# EAGLE schematic cyclops (EAGLE 8.3.2)
DESIGNER: JONATHAN P. NEWMAN; DOC_NUMBER: N/A; REVISION: 3.7
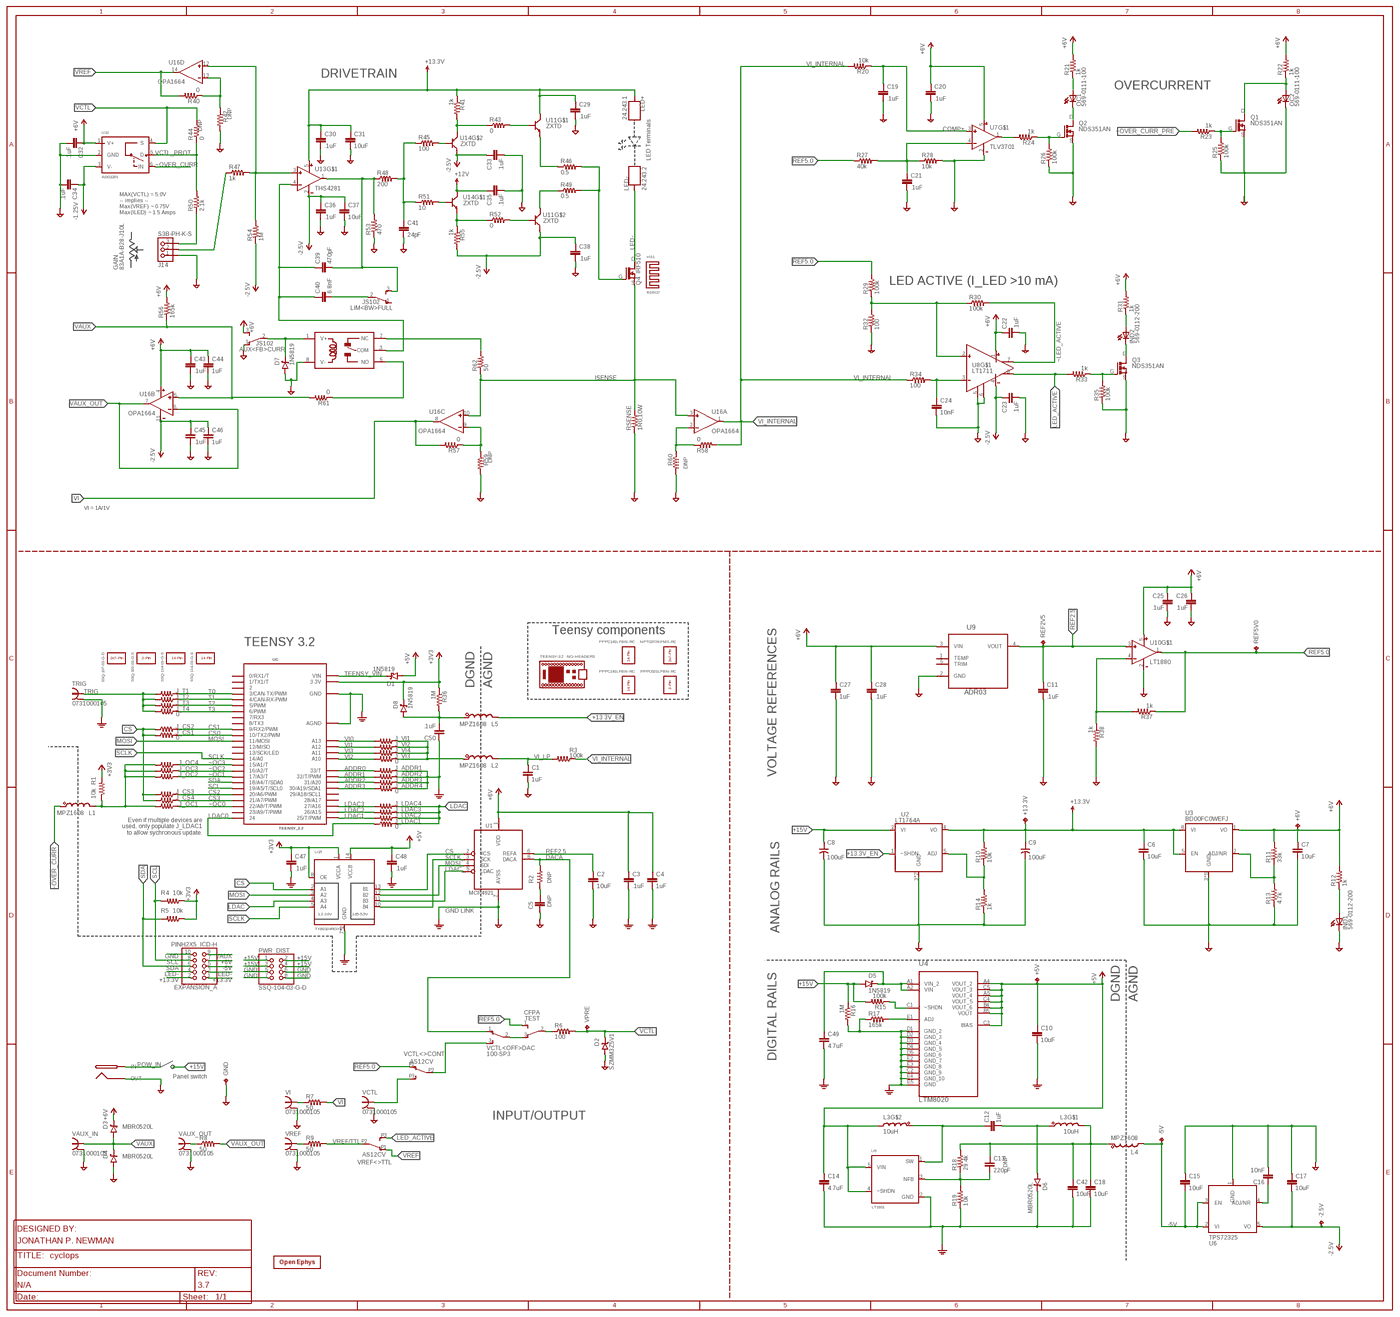
[diagram p0: schematic, sheet 1, overview]
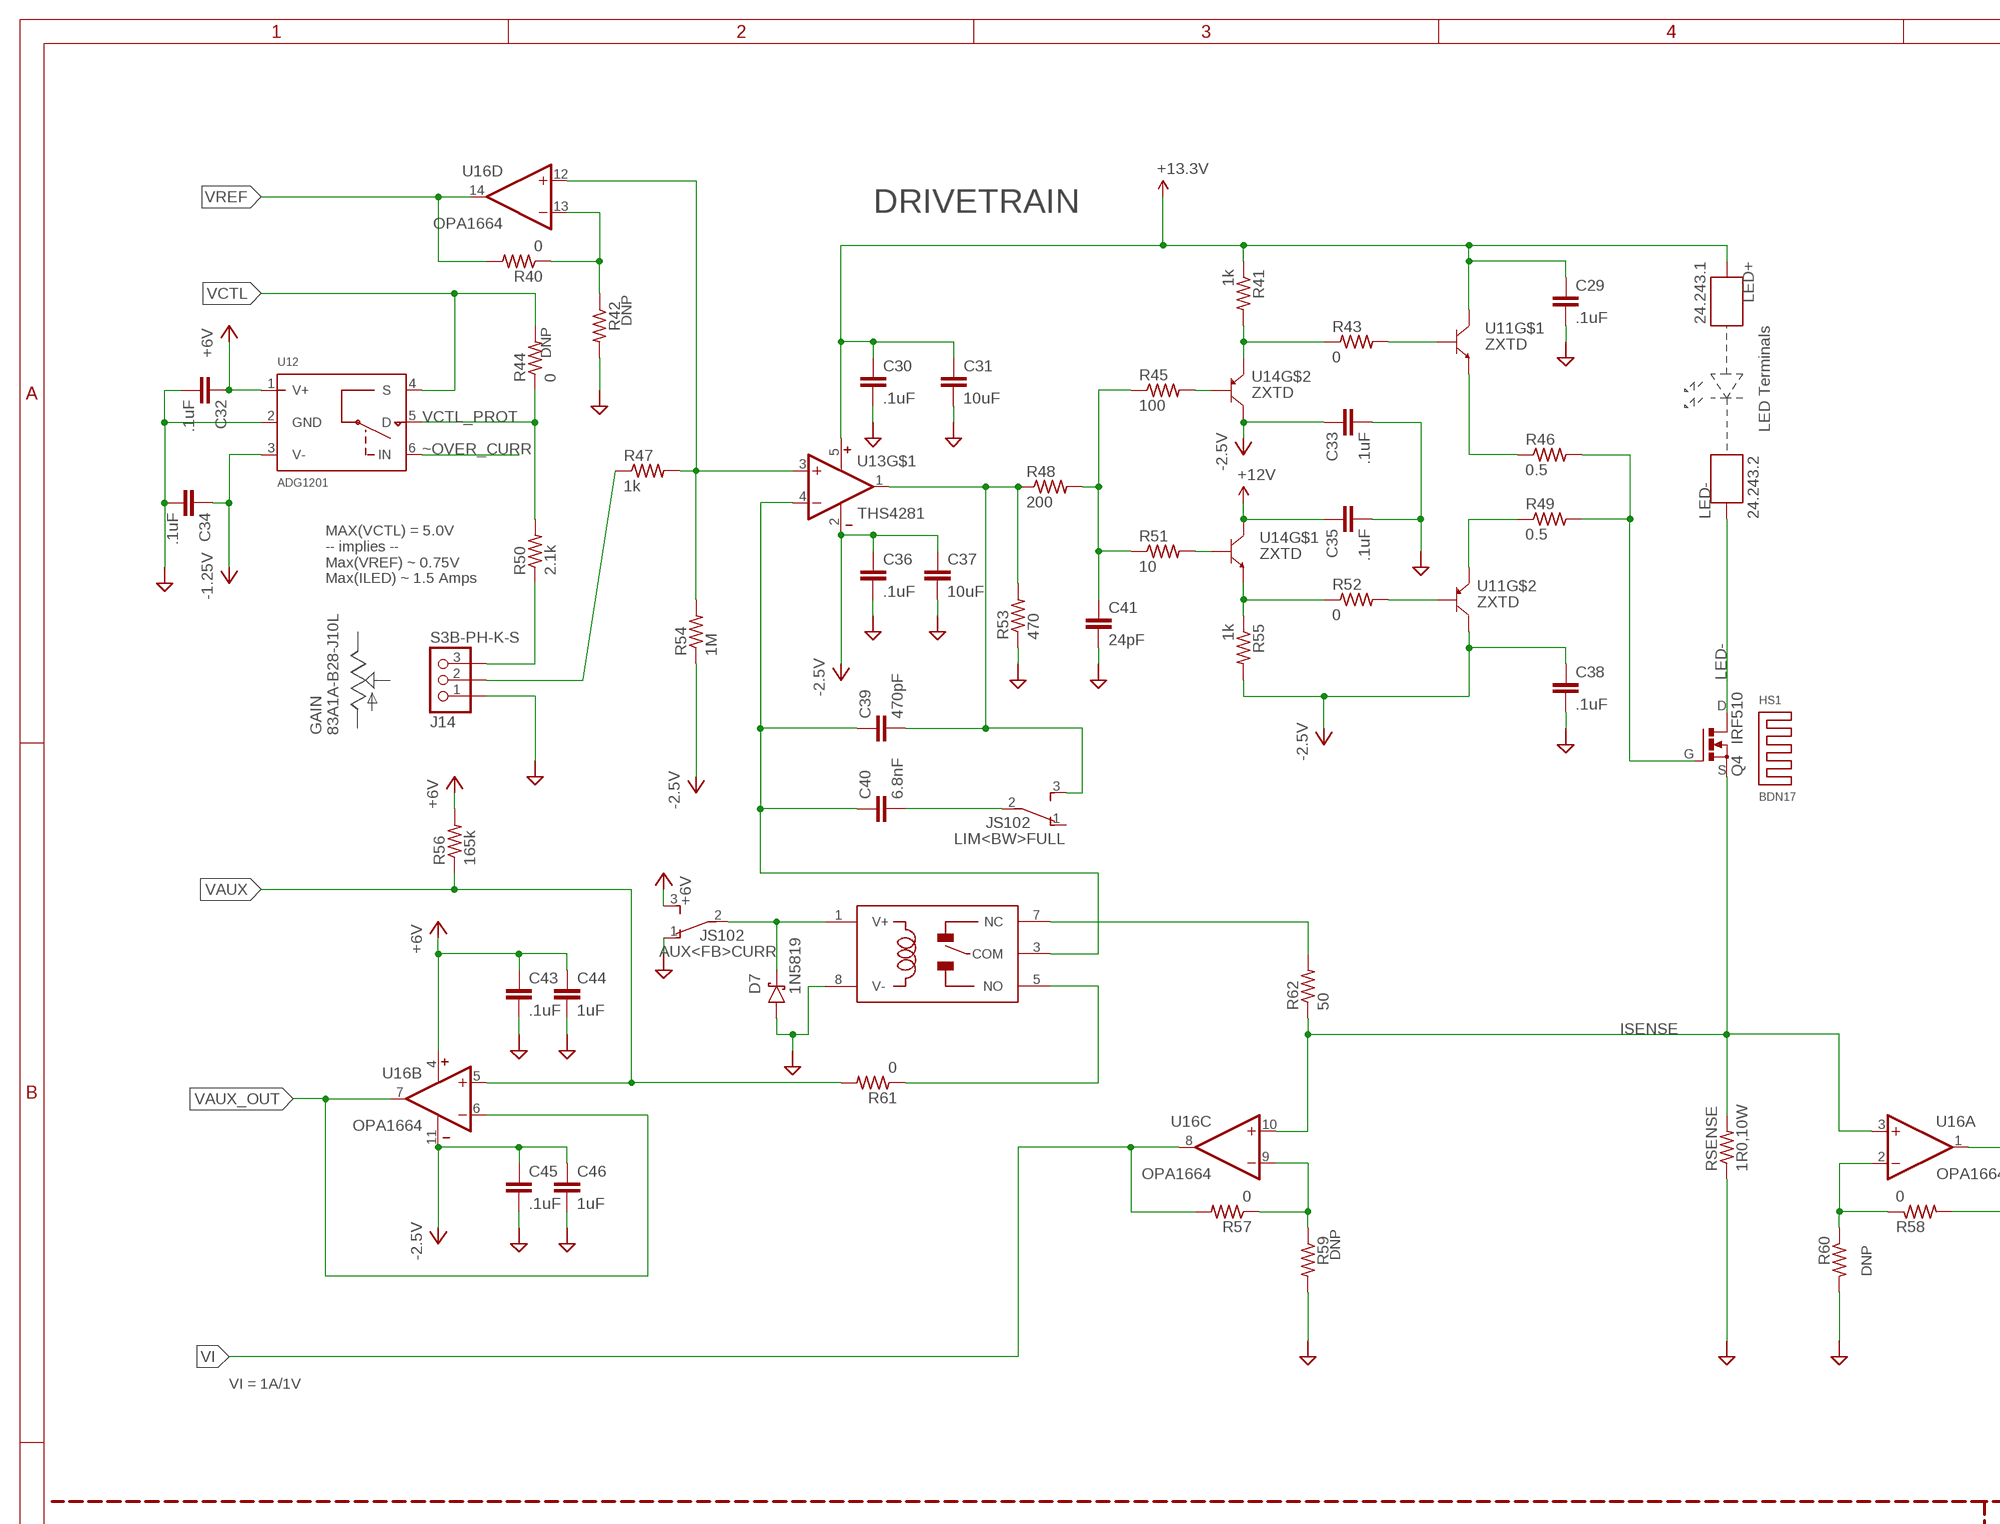
[diagram p1: schematic, sheet 1, part 1 of 4]
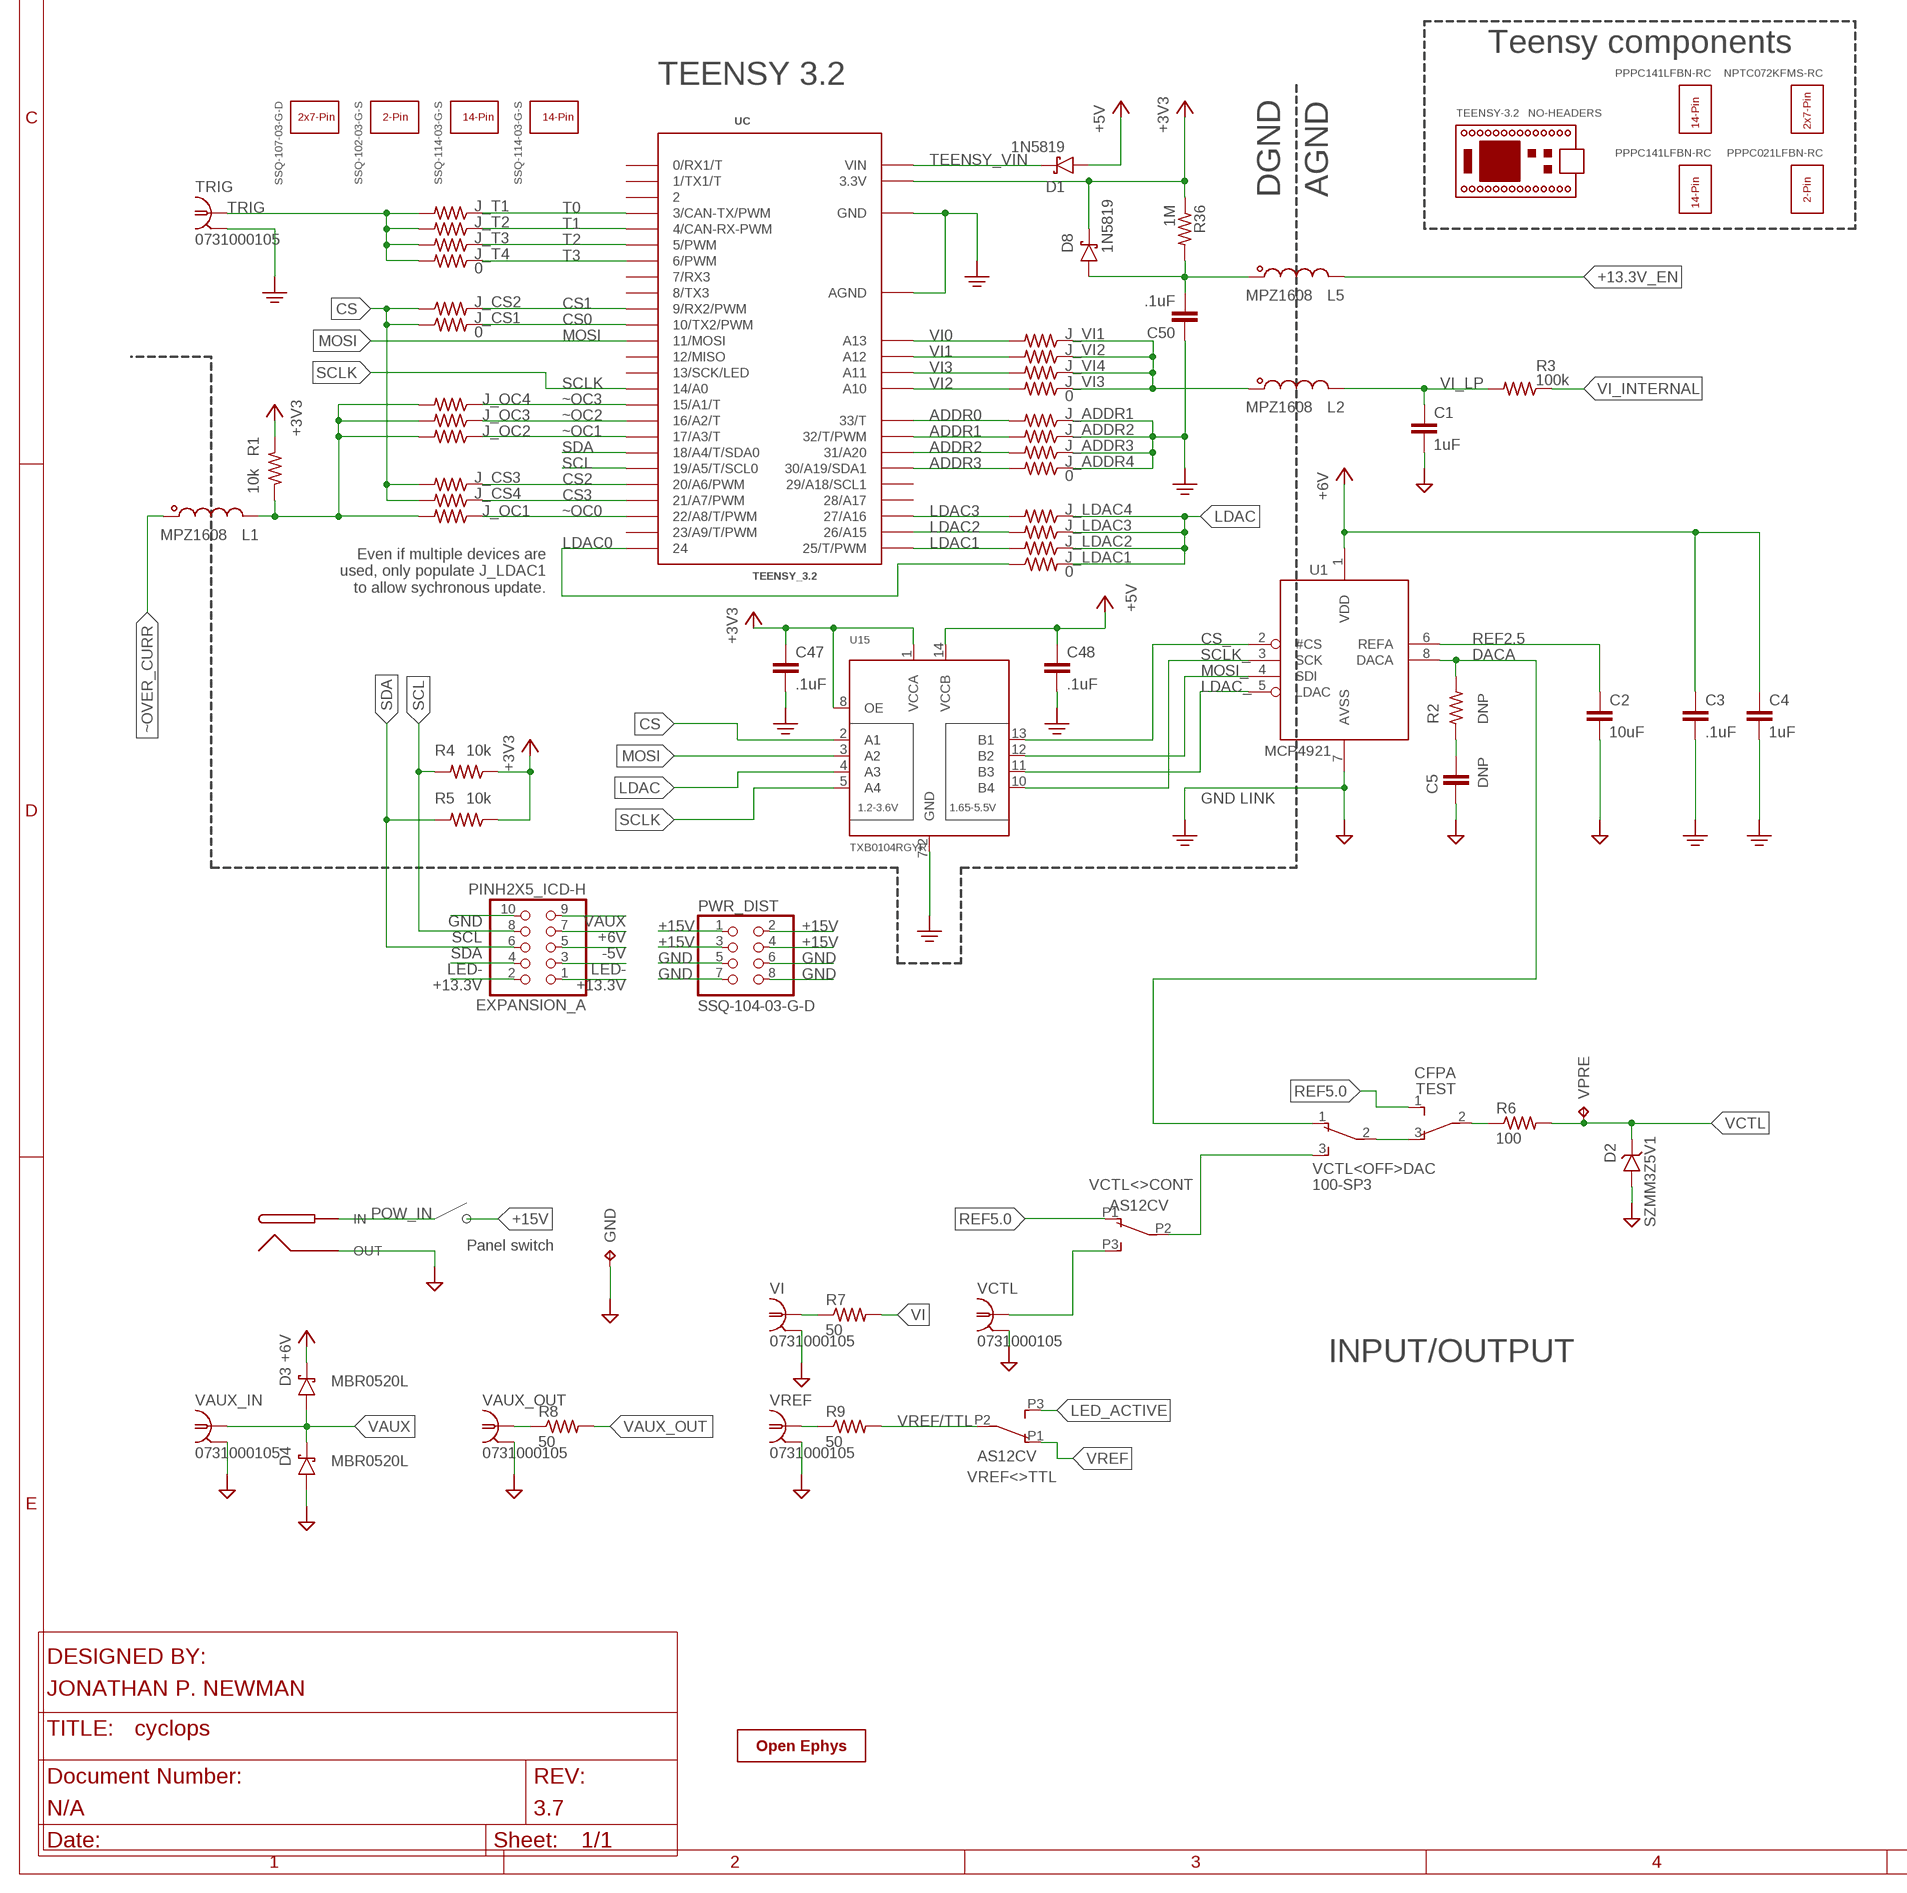
[diagram p2: schematic, sheet 1, part 2 of 4]
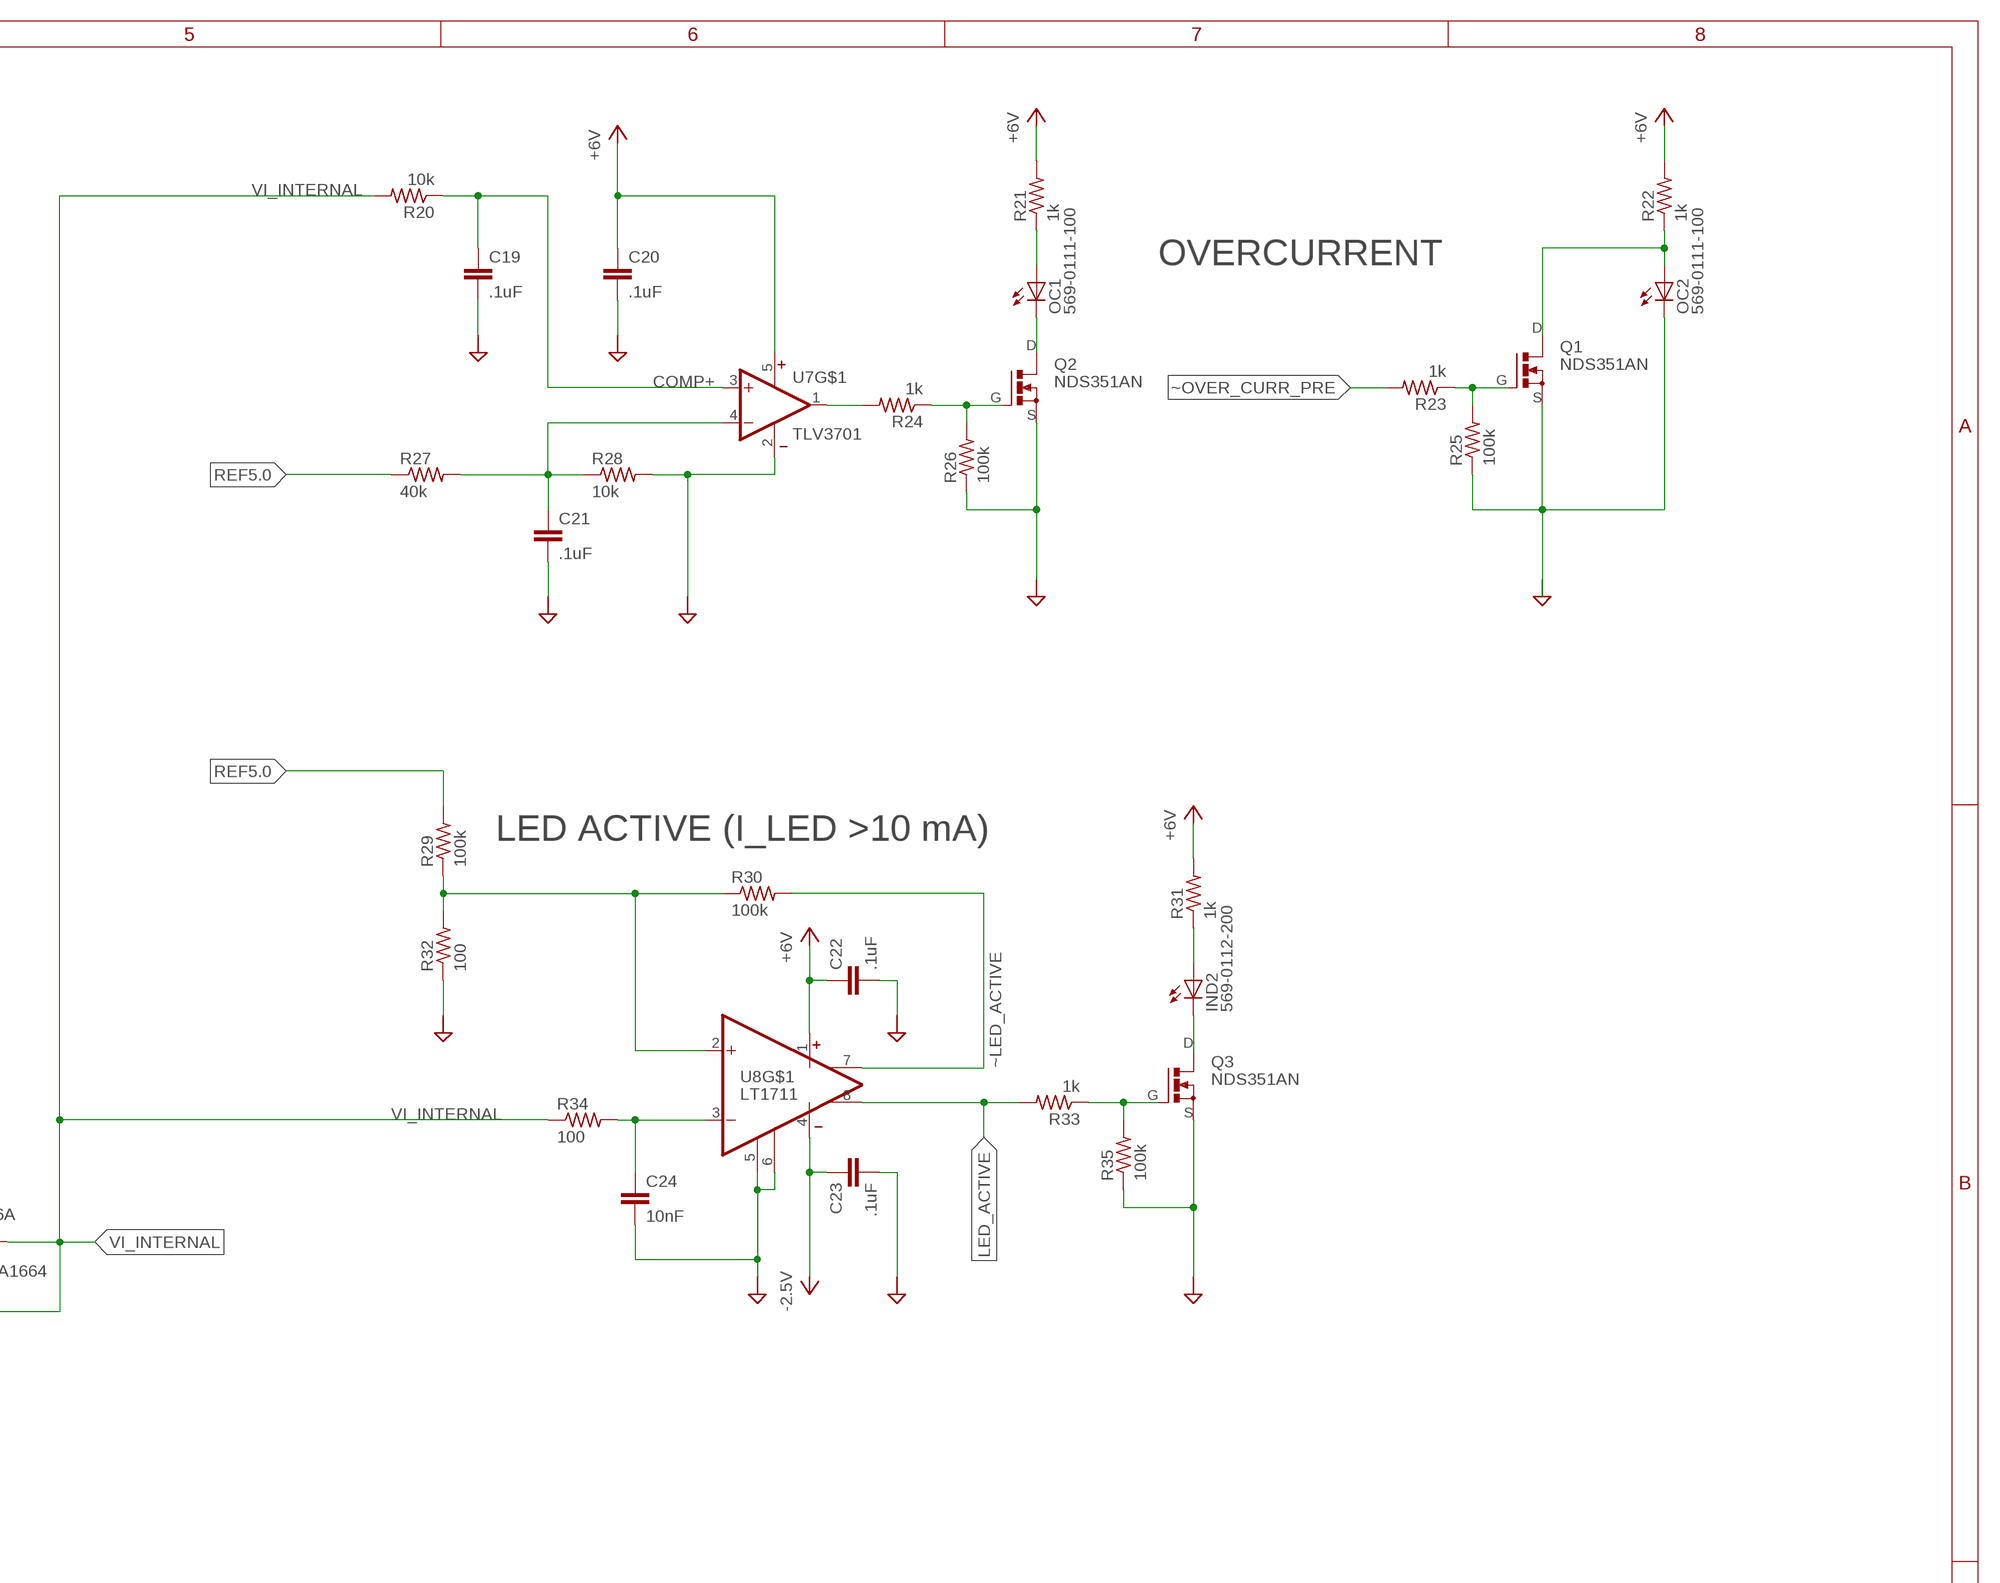
[diagram p3: schematic, sheet 1, part 3 of 4]
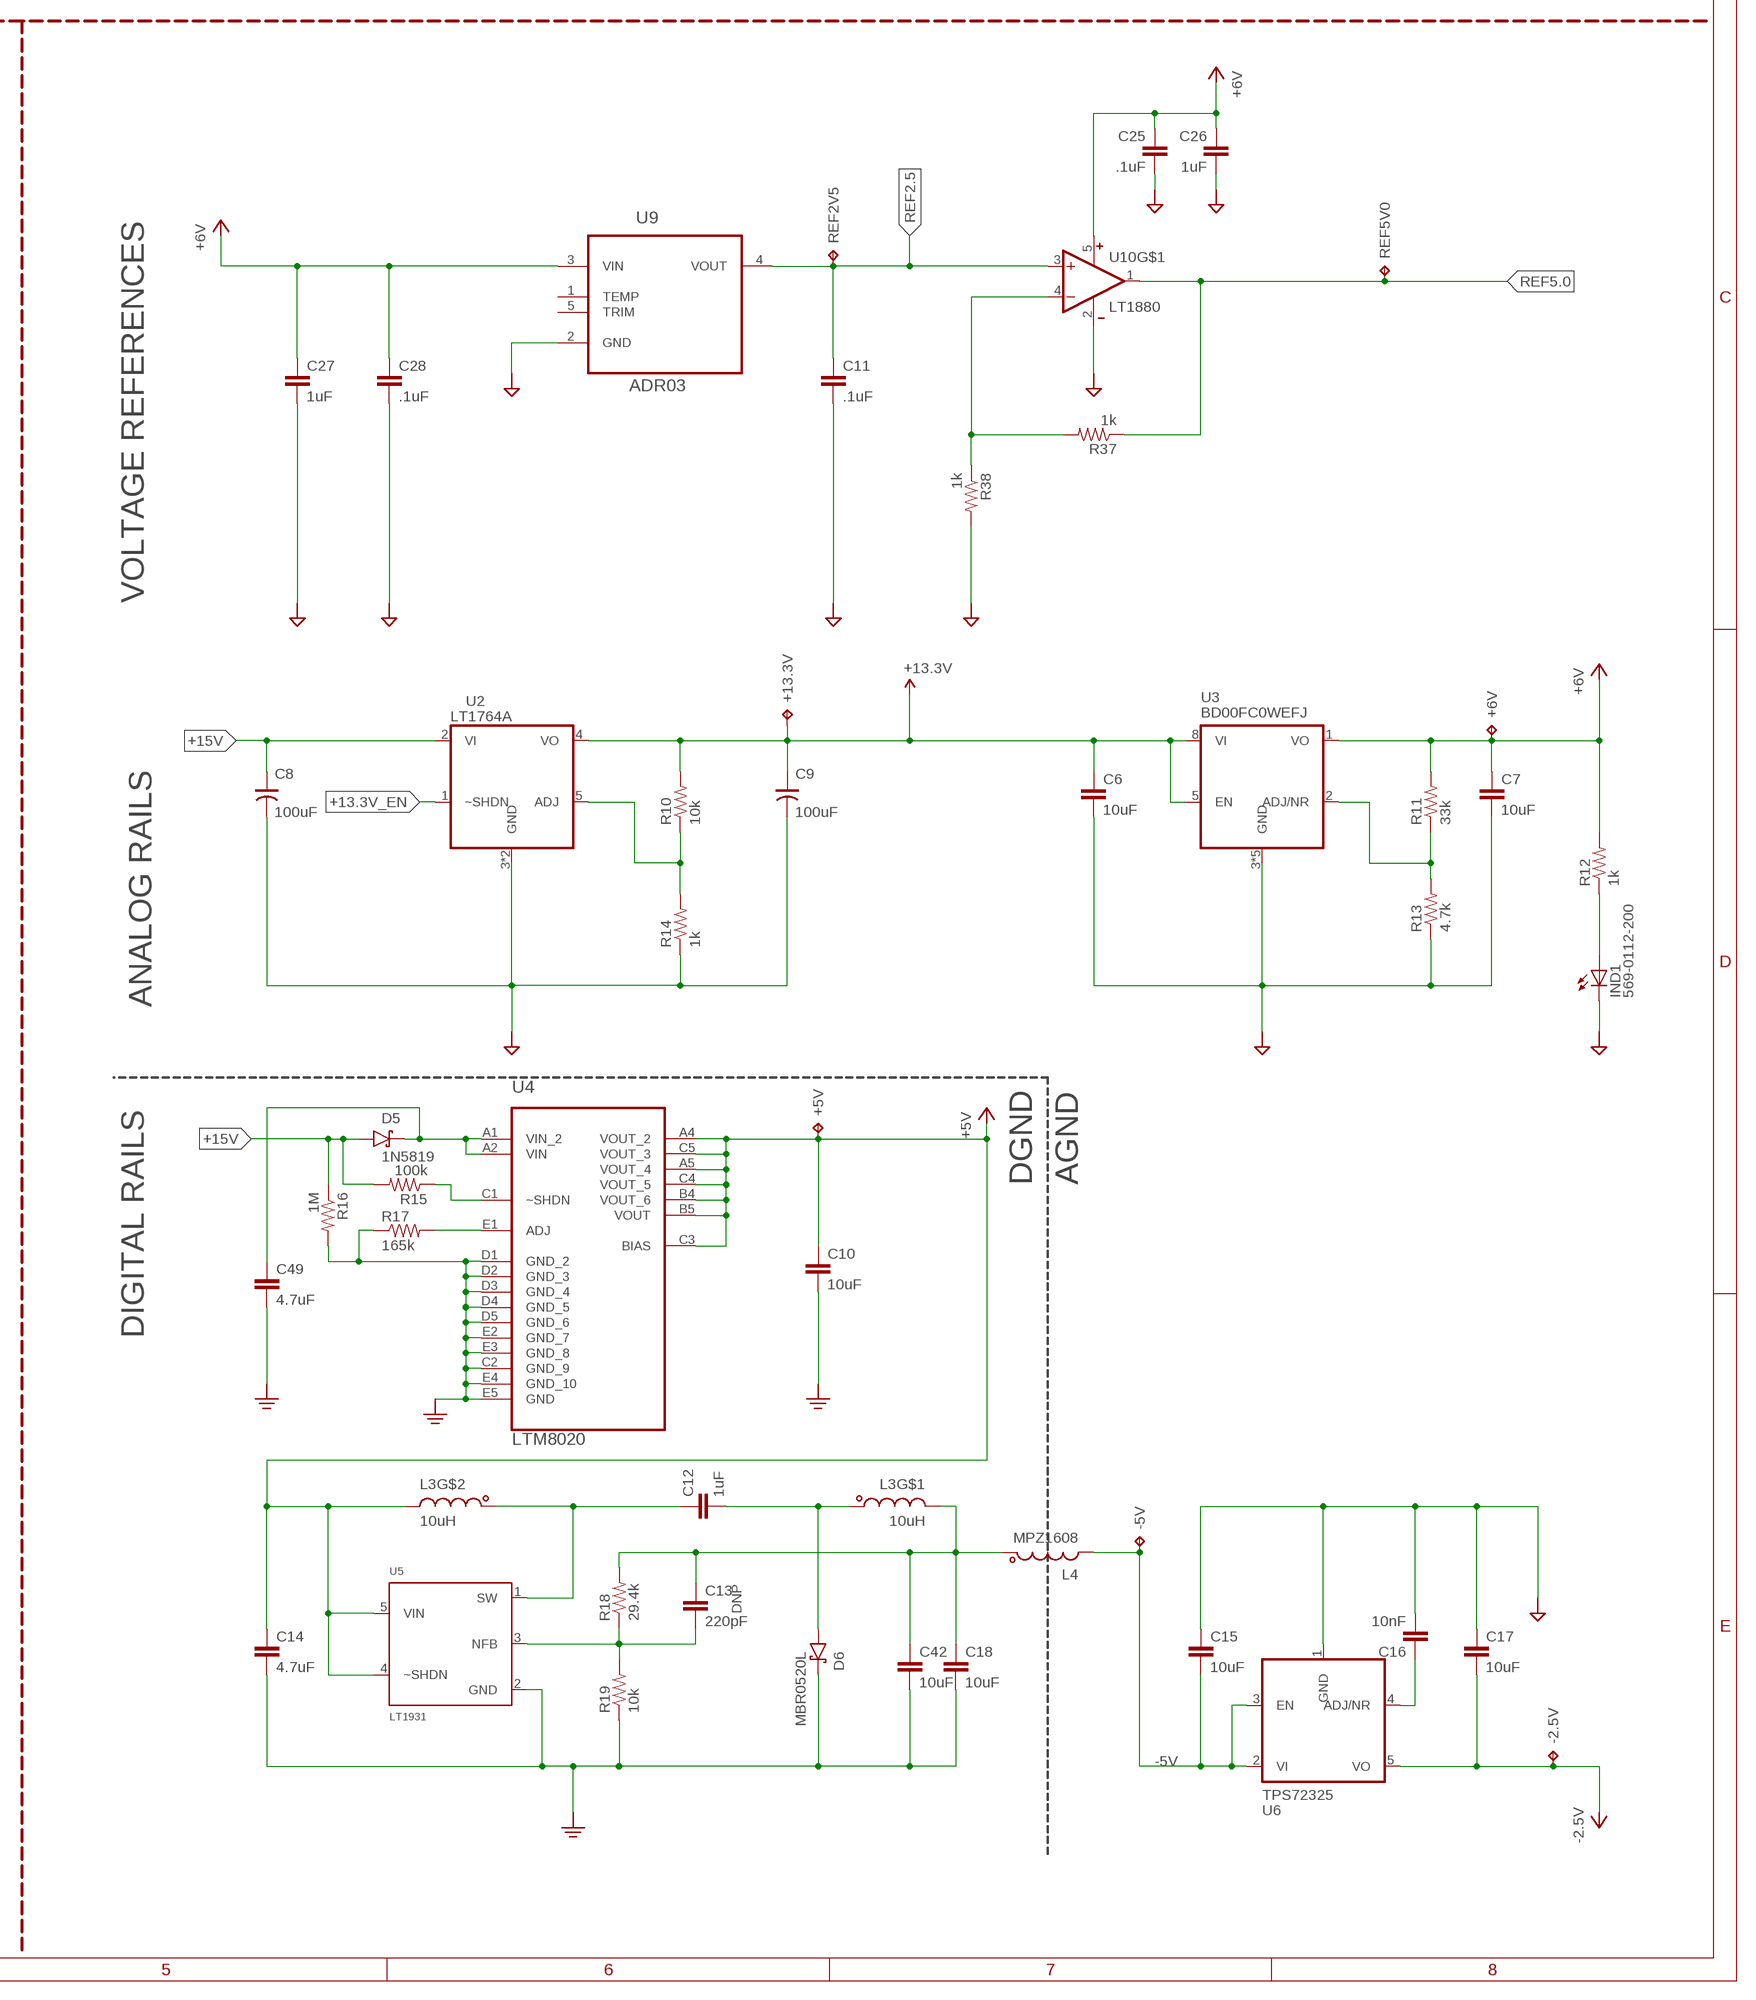
[diagram p4: schematic, sheet 1, part 4 of 4]

## Parts
+5V  RCU-0C  TP_RC0603  [RC0603]
+6V  RCU-0C  TP_RC0603  [RC0603]
+13.3V  RCU-0C  TP_RC0603  [RC0603]
-2.5V  RCU-0C  TP_RC0603  [RC0603]
-5V  RCU-0C  TP_RC0603  [RC0603]
AUX<FB>CURR  JS102  SPDT_JS  [JS102011SAQN]
C1  1uF  C_0805  [0805]
C2  10uF  C_1206  [1206]
C3  .1uF  C_0603  [0603]
C4  1uF  C_0805  [0805]
C5  C_0603  [0603]
C6  10uF  C_1206  [1206]
C7  10uF  C_1206  [1206]
C8  100uF  C-POL_0807  [153CLV-0807]
C9  100uF  C-POL_0807  [153CLV-0807]
C10  10uF  C_1206  [1206]
C11  .1uF  C_0603  [0603]
C12  1uF  C_0805  [0805]
C13  220pF  C_0603  [0603]
C14  4.7uF  C_1206  [1206]
C15  10uF  C_1206  [1206]
C16  10nF  C_0603  [0603]
C17  10uF  C_1206  [1206]
C18  10uF  C_1206  [1206]
C19  .1uF  C_0603  [0603]
C20  .1uF  C_0603  [0603]
C21  .1uF  C_0603  [0603]
C22  .1uF  C_0603  [0603]
C23  .1uF  C_0603  [0603]
C24  10nF  C_0603  [0603]
C25  .1uF  C_0603  [0603]
C26  1uF  C_0805  [0805]
C27  1uF  C_0805  [0805]
C28  .1uF  C_0603  [0603]
C29  .1uF  C_0603  [0603]
C30  .1uF  C_0603  [0603]
C31  10uF  C_1206  [1206]
C32  .1uF  C_0603  [0603]
C33  .1uF  C_0603  [0603]
C34  .1uF  C_0603  [0603]
C35  .1uF  C_0603  [0603]
C36  .1uF  C_0603  [0603]
C37  10uF  C_1206  [1206]
C38  .1uF  C_0603  [0603]
C39  470pF  C_0603  [0603]
C40  6.8nF  C_0603  [0603]
C41  24pF  C_0603  [0603]
C42  10uF  C_1206  [1206]
C43  .1uF  C_0603  [0603]
C44  1uF  C_0805  [0805]
C45  .1uF  C_0603  [0603]
C46  1uF  C_0805  [0805]
C47  .1uF  C_0603  [0603]
C48  .1uF  C_0603  [0603]
C49  4.7uF  C_1206  [1206]
C50  .1uF  C_0603  [0603]
D1  1N5819  S-DIODESOD-123  [SOD123]
D2  SZMM3Z5V1  Z-DIODE_SOD-323  [SOD-323]
D3  MBR0520L  S-DIODESOD-123  [SOD123]
D4  MBR0520L  S-DIODESOD-123  [SOD123]
D5  1N5819  S-DIODESOD-123  [SOD123]
D6  MBR0520L  S-DIODESOD-123  [SOD123]
D7  1N5819  S-DIODESOD-123  [SOD123]
D8  1N5819  S-DIODESOD-123  [SOD123]
EXPANSION_A  PINH2X5_ICD-H  [2X05-IDC]
GND  RCU-0C  TP_RC0603  [RC0603]
HS1  BDN17  HEATSINK_BDN17  [BDN17]
IND  569-0112-200  LED_2X_VERTICAL  [569-011X-X00_LED_ARRAY]
J14  S3B-PH-K-S  PINHD-1X3_S3B-PH-K-S  [S3B-PH-K-S]
J_ADDR1  0  R_0402  [0402]
J_ADDR2  0  R_0402  [0402]
J_ADDR3  0  R_0402  [0402]
J_ADDR4  0  R_0402  [0402]
J_CS1  0  R_0402  [0402]
J_CS2  0  R_0402  [0402]
J_CS3  0  R_0402  [0402]
J_CS4  0  R_0402  [0402]
J_LDAC1  0  R_0402  [0402]
J_LDAC2  0  R_0402  [0402]
J_LDAC3  0  R_0402  [0402]
J_LDAC4  0  R_0402  [0402]
J_OC1  0  R_0402  [0402]
J_OC2  0  R_0402  [0402]
J_OC3  0  R_0402  [0402]
J_OC4  0  R_0402  [0402]
J_T1  0  R_0402  [0402]
J_T2  0  R_0402  [0402]
J_T3  0  R_0402  [0402]
J_T4  0  R_0402  [0402]
J_VI1  0  R_0402  [0402]
J_VI2  0  R_0402  [0402]
J_VI3  0  R_0402  [0402]
J_VI4  0  R_0402  [0402]
L1  MPZ1608  L_0603  [0603]
L2  MPZ1608  L_0603  [0603]
L3  10uH  2L_CLS62  [CLS62]
L4  MPZ1608  L_0603  [0603]
L5  MPZ1608  L_0603  [0603]
LED+  24.243.1  BANANA_TO_BOARD_A2107  [A-2107]
LED-  24.243.2  BANANA_TO_BOARD_A2107  [A-2107]
LIM<BW>FULL  JS102  SPDT_JS  [JS102011SAQN]
OC  569-0111-100  LED_2X_VERTICAL  [569-011X-X00_LED_ARRAY]
POWER  PJ-063BH  BARREL-JACK_PJ-063BH  [PJ-063BH]
PWR_DIST  SSQ-104-03-G-D  PINH2X4  [2X04-BIG]
Q1  NDS351AN  N-MOSFET_SOT23-GSD  [SOT23-GSD]
Q2  NDS351AN  N-MOSFET_SOT23-GSD  [SOT23-GSD]
Q3  NDS351AN  N-MOSFET_SOT23-GSD  [SOT23-GSD]
Q4  IRF510  N-MOSFETTO-262  [TO-262_01]
R1  10k  R_0603  [0603]
R2  R_0603  [0603]
R3  100k  R_0603  [0603]
R4  10k  R_0603  [0603]
R5  10k  R_0603  [0603]
R6  100  R_0603  [0603]
R7  50  R_1206  [1206]
R8  50  R_1206  [1206]
R9  50  R_1206  [1206]
R10  10k  R_0603  [0603]
R11  33k  R_0603  [0603]
R12  1k  R_0603  [0603]
R13  4.7k  R_0603  [0603]
R14  1k  R_0603  [0603]
R15  100k  R_0603  [0603]
R16  1M  R_0603  [0603]
R17  165k  R_0603  [0603]
R18  29.4k  R_0603  [0603]
R19  10k  R_0603  [0603]
R20  10k  R_0603  [0603]
R21  1k  R_0603  [0603]
R22  1k  R_0603  [0603]
R23  1k  R_0603  [0603]
R24  1k  R_0603  [0603]
R25  100k  R_0603  [0603]
R26  100k  R_0603  [0603]
R27  40k  R_0603  [0603]
R28  10k  R_0603  [0603]
R29  100k  R_0603  [0603]
R30  100k  R_0603  [0603]
R31  1k  R_0603  [0603]
R32  100  R_0603  [0603]
R33  1k  R_0603  [0603]
R34  100  R_0603  [0603]
R35  100k  R_0603  [0603]
R36  1M  R_0603  [0603]
R37  1k  R_0603  [0603]
R38  1k  R_0603  [0603]
R40  0  R_0603  [0603]
R41  1k  R_0603  [0603]
R42  R_0603  [0603]
R43  0  R_0603  [0603]
R44  0  R_0603  [0603]
R45  100  R_0603  [0603]
R46  0.5  R_0603  [0603]
R47  1k  R_0603  [0603]
R48  200  R_0603  [0603]
R49  0.5  R_0603  [0603]
R50  2.1k  R_0603  [0603]
R51  10  R_0603  [0603]
R52  0  R_0603  [0603]
R53  470  R_0603  [0603]
R54  1M  R_0603  [0603]
R55  1k  R_0603  [0603]
R56  165k  R_0603  [0603]
R57  0  R_0603  [0603]
R58  0  R_0603  [0603]
R59  R_0603  [0603]
R60  R_0603  [0603]
R61  0  R_0603  [0603]
R62  50  R_1206  [1206]
REF2V5  RCU-0C  TP_RC0603  [RC0603]
REF5V0  RCU-0C  TP_RC0603  [RC0603]
RSENSE  1R0,10W  R_TO-252-THICK-FILM  [TO-252-THICK-FILM]
S1  1462042-8  SPDT_RELAY_1462042  [1462042]
TEST  CFPA  SPDT_CFPA  [CFPA]
TRIG  0731000105  BNC_0731000105  [0731000105]
U1  MCP4921  MCP4921SOIC  [SO08]
U2  LT1764A  LT1963_DDPAK  [5-DDPAK]
U3  BD00FC0WEFJ  LDO_ADJUST_BDXXFC0  [SOIC127P600X175-9N]
U4  LTM8020  LTM8020IVPBF  [LGA21C127P5X5_625X625X242]
U5  LT1931  LT1611  [SOT95P310X175-5N]
U6  TPS72325  LDO_ADJUST_TPS72325  [SOT-23-5]
U7  TLV3701  COMPARITOR_ADCMP600  [SOT-23-5]
U8  LT1711  [SOP65P490X110-8N]
U9  ADR03  ADR03AKSZ-REEL7  [SOT65P210X110-5N]
U10  LT1880  OPAMP_SOT-23  [SOT95P310X175-5N]
U11  ZXTD  ZXTD4591E6  [SOT23-6]
U12  ADG1201  SPST_IC_SOT23-6  [SOT23-6]
U13  THS4281  OPAMP_SOT-23  [SOT95P310X175-5N]
U14  ZXTD  ZXTD4591E6  [SOT23-6]
U15  TXB0104RGYR  TXB0104_14QFN  [14QFN_2X6_2X2]
U16  OPA1664  QUAD-OPAMP_14PIND  [SO14]
UC  TEENSY_3.2  TEENSY_3.1_CYCLOPS  [TEENSY_3.1_CYCLOPS]
VAUX_IN  0731000105  BNC_0731000105  [0731000105]
VAUX_OUT  0731000105  BNC_0731000105  [0731000105]
VCTL  0731000105  BNC_0731000105  [0731000105]
VCTL<>CONT  AS12CV  SPDT_AS12A*  [AS12A*_SPDT]
VCTL<OFF>DAC  100-SP3  SPDT_2M-WITHOFF  [2M1-SP1-T2-B4-M6RE]
VI  0731000105  BNC_0731000105  [0731000105]
VPRE  TPTP16R  TP_RC0603  [RC0603]
VREF  0731000105  BNC_0731000105  [0731000105]
VREF<>TTL  AS12CV  SPDT_AS12A*  [AS12A*_SPDT]
X1  OE-LOGO_14X10  [OE-LOGO-14X10]

## Nets
+3V3: C47.1 D8.C R1.2 R4.1 R5.1 R36.1 U15.1(VCCA) U15.8(OE) UC.3.3V UC.3.3V2(3.3V)
+5V: +5V.1(TP) C10.1 C14.1 C48.1 D1.A L3.3 U4.A4(VOUT_2) U4.A5(VOUT_4) U4.B4(VOUT_6) U4.B5(VOUT) U4.C3(BIAS) U4.C4(VOUT_5) U4.C5(VOUT_3) U5.4(~SHDN) U5.5(VIN) U15.14(VCCB)
+6V [pwr]: +6V.1(TP) AUX<FB>CURR.3 C3.1 C4.1 C7.1 C20.1 C22.1 C25.1 C26.1 C27.1 C28.1 C32.1 C43.1 C44.1 D3.C EXPANSION_A.7 R11.2 R12.2 R21.2 R22.2 R31.2 R56.2 U1.1(VDD) U3.1(VO) U7.5(V+) U8.1(V+) U9.3(VIN) U10.5(V+) U12.1(V+) U16.4(P:V+)
+13.3V [pwr]: +13.3V.1(TP) C6.1 C9.+ C29.1 C30.1 C31.1 C35.1 EXPANSION_A.1 EXPANSION_A.2 LED+.1 LED+.2 R10.2 R41.1 U2.4(VO) U3.5(EN) U3.8(VI) U11.1(C) U13.5(V+) U14.1(C) ; supply symbol labelled +12V
+13.3V_EN: L5.2 U2.1(~SHDN)
+15V [pwr]: C8.+ D5.A PWR_DIST.1 PWR_DIST.2 PWR_DIST.3 PWR_DIST.4 R15.2 R16.1 U2.2(VI)
-2.5V: -2.5V.1(TP) C17.2 C23.1 C33.1 C34.1 C36.1 C37.1 C38.1 C45.1 C46.1 R54.1 R55.2 U6.5(VO) U8.4(V-) U11.3(C) U12.3(V-) U13.2(V-) U14.3(C) U16.11(P:V-)
-5V: -5V.1(TP) C15.2 EXPANSION_A.5 L4.2 U6.2(VI) U6.3(EN)
_VREF: R47.2 R54.2 U13.3(+IN) U16.12(D:+IN)
ADDR0: J_ADDR1.2 UC.33(33/T)
ADDR1: J_ADDR2.2 UC.32(32/T/PWM)
ADDR2: J_ADDR3.2 UC.31(31/A20)
ADDR3: J_ADDR4.2 UC.30(30/A19/SDA1)
COMP+: C19.1 R20.1 U7.3(+IN)
CS: J_CS1.1 J_CS2.1 J_CS3.2 J_CS4.2 U15.2(A1)
CS0: J_CS1.2 UC.10(10/TX2/PWM)
CS1: J_CS2.2 UC.9(9/RX2/PWM)
CS2: J_CS3.1 UC.20/A6(20/A6/PWM)
CS3: J_CS4.1 UC.21/A7(21/A7/PWM)
CS_: U1.2(#CS) U15.13(B1)
DACA: R2.2 U1.8(DACA) VCTL<OFF>DAC.1
GND: AUX<FB>CURR.1 C1.2 C2.2 C3.2 C4.2 C5.2 C6.2 C7.2 C8.- C9.- C10.2 C11.2 C14.2 C15.1 C16.2 C17.1 C18.2 C19.2 C20.2 C21.2 C22.2 C23.2 C24.2 C25.2 C26.2 C27.2 C28.2 C29.2 C30.2 C31.2 C32.2 C33.2 C34.2 C35.2 C36.2 C37.2 C38.2 C41.2 C42.2 C43.2 C44.2 C45.2 C46.2 C47.2 C48.2 C49.2 C50.1 D2.A D4.A D6.C D7.A EXPANSION_A.10 GND.1(TP) IND.C1(1:C) J14.1 J_ADDR1.1 J_ADDR2.1 J_ADDR3.1 J_ADDR4.1 OC.C2(2:C) POWER.2(OUT) PWR_DIST.5 PWR_DIST.6 PWR_DIST.7 PWR_DIST.8 Q1.S Q2.S Q3.S R13.1 R14.1 R16.2 R17.1 R19.1 R25.1 R26.1 R28.2 R32.1 R35.1 R38.2 R42.2 R53.1 R59.2 R60.2 RSENSE.1 S1.8(V-) TRIG.2 TRIG.3 U1.7(AVSS) U2.3(GND) U2.TAB(GND) U3.3(GND) U3.4(GND) U3.6(GND) U3.7(GND) U3.9(GND) U4.C2(GND_9) U4.D1(GND_2) U4.D2(GND_3) U4.D3(GND_4) U4.D4(GND_5) U4.D5(GND_6) U4.E2(GND_7) U4.E3(GND_8) U4.E4(GND_10) U4.E5(GND) U5.2(GND) U6.1(GND) U7.2(V-) U8.5(LATCH) U8.6(GND) U9.2(GND) U10.2(V-) U12.2(GND) U15.7(GND) U15.PAD(GND) UC.AGND UC.GND UC.GND2(GND) VAUX_IN.2 VAUX_IN.3 VAUX_OUT.2 VAUX_OUT.3 VCTL.2 VCTL.3 VI.2 VI.3 VREF.2 VREF.3
IN: AUX<FB>CURR.2 D7.C S1.1(V+)
ISENSE: Q4.S R62.1 RSENSE.2 U16.3(A:+IN) U16.10(C:+IN)
LDAC: J_LDAC1.2 J_LDAC2.1 J_LDAC3.1 J_LDAC4.1 U15.4(A3)
LDAC0: J_LDAC1.1 UC.24
LDAC1: J_LDAC2.2 UC.25(25/T/PWM)
LDAC2: J_LDAC3.2 UC.26(26/A15)
LDAC3: J_LDAC4.2 UC.27(27/A16)
LDAC_: U1.5(LDAC) U15.11(B3)
LED-: EXPANSION_A.3 EXPANSION_A.4 LED-.1 LED-.2 Q4.D
LED_ACTIVE: R33.2 U8.8(~Q) VREF<>TTL.P3
MOSI: U15.3(A2) UC.11(11/MOSI)
MOSI_: U1.4(SDI) U15.12(B2)
N$1: C5.1 R2.1
N$2: OC.A1(1:A) R21.1
N$3: IND.A1(1:A) R12.1
N$4: R41.2 R43.1 U14.4(E)
N$5: C21.1 R27.2 R28.1 U7.4(-IN)
N$6: C50.2 D8.A L5.1 R36.2
N$7: C24.1 R34.2 U8.3(-IN)
N$8: R40.1 R42.1 U16.13(D:-IN)
N$9: OC.C1(1:C) Q2.D
N$10: R52.1 R55.1 U14.6(E)
N$11: R58.1 R60.1 U16.2(A:-IN)
N$12: R10.1 R14.2 U2.5(ADJ)
N$13: C39.2 LIM<BW>FULL.3 R48.1 R53.2 U13.1(OUT)
N$14: R6.1 TEST.2
N$15: R57.1 R59.1 U16.9(C:-IN)
N$18: R37.2 R38.1 U10.4(-IN)
N$19: VCTL.1 VCTL<>CONT.P3
N$21: C49.1 D5.C U4.A1(VIN_2) U4.A2(VIN)
N$23: R15.1 U4.C1(~SHDN)
N$24: R49.1 U11.4(E)
N$25: R46.1 U11.6(E)
N$26: Q4.G R46.2 R49.2
N$27: R24.2 U7.1(OUT)
N$28: Q2.G R24.1 R26.2
N$32: C12.1 L3.2 U5.1(SW)
N$33: C12.2 D6.A L3.1
N$34: TEST.3 VCTL<OFF>DAC.2
N$35: C13.1 C18.1 C42.1 L3.4 L4.1 R18.2
N$36: C13.2 R18.1 R19.2 U5.3(NFB)
N$37: J14.2 R47.1
N$38: R17.2 U4.E1(ADJ)
N$39: Q1.G R23.1 R25.2
N$40: C40.2 LIM<BW>FULL.2
N$41: OC.A2(2:A) Q1.D R22.1
N$42: R29.1 R30.1 R32.2 U8.2(+IN)
N$43: R11.1 R13.2 U3.2(ADJ/NR)
N$44: R52.2 U11.5(B)
N$45: R43.2 U11.2(B)
N$46: IND.A2(2:A) R31.1
N$47: IND.C2(2:C) Q3.D
N$48: R51.2 U14.2(B)
N$49: Q3.G R33.1 R35.2
N$50: R45.2 U14.5(B)
N$51: C16.1 U6.4(ADJ/NR)
N$52: R8.1 VAUX_OUT.1
N$53: C39.1 C40.1 S1.3(COM) U13.4(-IN)
N$54: R7.1 VI.1
N$55: R9.1 VREF.1
N$56: R62.2 S1.7(NC)
N$57: R61.1 S1.5(NO)
N$58: C41.1 R45.1 R48.2 R51.1
POW_IN [pwr]: POWER.1(IN)
REF2.5: C2.1 C11.1 REF2V5.1(TP) U1.6(REFA) U9.4(VOUT) U10.3(+IN)
REF5.0: R27.1 R29.2 R37.1 REF5V0.1(TP) TEST.1 U10.1(OUT) VCTL<>CONT.P1
SCL: EXPANSION_A.8 R4.2 UC.19/A5(19/A5/T/SCL0)
SCLK: U15.5(A4) UC.14/A0
SCLK_: U1.3(SCK) U15.10(B4)
SDA: EXPANSION_A.6 R5.2 UC.18/A4(18/A4/T/SDA0)
T0: J_T1.1 UC.3(3/CAN-TX/PWM)
T1: J_T2.1 UC.4(4/CAN-RX-PWM)
T2: J_T3.1 UC.5(5/PWM)
T3: J_T4.1 UC.6(6/PWM)
TEENSY_VIN: D1.C UC.VIN
TRIG: J_T1.2 J_T2.2 J_T3.2 J_T4.2 TRIG.1
VAUX: D3.A D4.C EXPANSION_A.9 R56.1 R61.2 U16.5(B:+IN) VAUX_IN.1
VAUX_OUT: R8.2 U16.6(B:-IN) U16.7(B:OUT)
VCTL: D2.C R6.2 R44.2 U12.4(S) VPRE.1(TP)
VCTL_PROT: R44.1 R50.2 U12.5(D)
VCTL_PROTECT: J14.3 R50.1
VI: R7.2 R57.2 U16.8(C:OUT)
VI0: J_VI1.2 UC.A13
VI1: J_VI2.2 UC.A12
VI2: J_VI3.2 UC.A10
VI3: J_VI4.2 UC.A11
VI_IN: J_VI1.1 J_VI2.1 J_VI3.1 J_VI4.1 L2.1
VI_INTERNAL: R3.1 R20.2 R34.1 R58.2 U16.1(A:OUT)
VI_LP: C1.1 L2.2 R3.2
VINPUT: VCTL<>CONT.P2 VCTL<OFF>DAC.3
VREF: R40.2 U16.14(D:OUT) VREF<>TTL.P1
VREF/TTL: R9.2 VREF<>TTL.P2
~LED_ACTIVE: R30.2 U8.7(Q)
~OC0: J_OC1.1 UC.22/A8(22/A8/T/PWM)
~OC1: J_OC2.1 UC.17/A3(17/A3/T)
~OC2: J_OC3.1 UC.16/A2(16/A2/T)
~OC3: J_OC4.1 UC.15/A1(15/A1/T)
~OVER_CURR: L1.1 U12.6(IN)
~OVER_CURR_PRE: J_OC1.2 J_OC2.2 J_OC3.2 J_OC4.2 L1.2 R1.1 R23.2
Unconnected: LIM<BW>FULL.1 U9.1(TEMP) U9.5(TRIM) UC.0(0/RX1/T) UC.1(1/TX1/T) UC.2 UC.7(7/RX3) UC.8(8/TX3) UC.12(12/MISO) UC.13(13/SCK/LED) UC.23/A9(23/A9/T/PWM) UC.28(28/A17) UC.29(29/A18/SCL1)

## Notes on the sheet
- DRIVETRAIN
- OVERCURRENT
- DNP | LED Terminals
- DNP
- MAX(VCTL) = 5.0V
  -- implies --
  Max(VREF) ~ 0.75V
  Max(ILED) ~ 1.5 Amps
- GAIN
  83A1A-B28-J10L
- LED ACTIVE (I_LED >10 mA)
- DNP
- DNP
- VI = 1A/1V
- Teensy components
- TEENSY 3.2
- DGND | AGND
- VOLTAGE REFERENCES
- Even if multiple devices are
  used, only populate J_LDAC1
  to allow sychronous update.
- DNP
- DNP
- GND LINK
- ANALOG RAILS
- DGND | AGND
- DIGITAL RAILS
- Panel switch
- INPUT/OUTPUT
- DNP

## Library data of the parts
+5V +6V +13.3V -2.5V -5V GND REF2V5 REF5V0 VPRE = jonnew:TP: Test pad
AUX<FB>CURR LIM<BW>FULL TEST VCTL<OFF>DAC = cyclops:SPDT: SPDT Switch
C1 C4 C26 C27 C44 C46 = cyclops:C: Capacitor; MN: TDK Corp.; PARTNO: C2012X5R1Cxxxxxxx; VID: DK
C2 C3 C5 C10 C11 C13 C14 C19-C25 C28 C30-C37 C39-C41 C43 C45 C47-C50 = cyclops:C: Capacitor
C6 C7 C15-C18 C29 C38 C42 = jonnew:C: Capacitor
C8 C9 = cyclops:C-POL: Polarized Capacitor
C12 = jonnew:C: Capacitor; MN: TDK Corp.; PARTNO: C2012X5R1Cxxxxxxx; VID: DK
D1 D3-D5 D7 D8 = jonnew:S-DIODE: Schottky Diode
D2 = cyclops:Z-DIODE: Zener Diode
D6 = cyclops:S-DIODE: Schottky Diode
EXPANSION_A = cyclops:PINH2X5
HS1 = jonnew:HEATSINK
IND OC = jonnew:LED_2X
J14 = jonnew:PINHD-1X3
J_ADDR1-J_ADDR4 J_CS1-J_CS4 J_LDAC1-J_LDAC4 J_OC1-J_OC4 J_T1-J_T4 J_VI1-J_VI4 R7-R9 R62 RSENSE = jonnew:R: Resistor
L1 L2 L4 L5 = cyclops:L: Inductor
L3 = cyclops:2L
LED+ LED- = cyclops:BANANA_TO_BOARD: Female banana socket to board, right angle. Digikey part: J111-ND (or similar).
POWER = cyclops:BARREL-JACK
PWR_DIST = cyclops:PINH2X4
Q1-Q3 = jonnew:N-MOSFET: N-CHANNEL MOS FET SYMBOL
Q4 = cyclops:N-MOSFET: N-CHANNEL MOS FET SYMBOL
R1-R5 R10-R38 R40-R61 = cyclops:R: Resistor; DK: PxxxxHTR-ND; MN: Panasonic; MPN: ERJ-3EKFxxxxV
R6 = jonnew:R: Resistor; DK: PxxxxHTR-ND; MN: Panasonic; MPN: ERJ-3EKFxxxxV
S1 = jonnew:SPDT_RELAY
TRIG VAUX_IN VAUX_OUT VCTL VI VREF = jonnew:BNC: BNC CONNECTOR M/A COM www.macom.com distributor Farnell 149-452
U1 = cyclops:MCP4921: 12-bit DAC with SPI interface Microchip Technoligies
U2 = cyclops:LT1963: 1.5A, Low Noise Fast Transient Response LDO Regulators
U3 U6 = jonnew:LDO_ADJUST
U4 = jonnew:LTM8020IVPBF: 200mA, 36V DC/DC ìModule Regulator; MPN: LTM8020IV#PBF; OC_FARNELL: 1799823; OC_NEWARK: 01N6436; PACKAGE: LGA-21; SUPPLIER: Linear Technology
U5 = cyclops:LT1611
U7 = jonnew:COMPARITOR
U8 = jonnew:LT1711
U9 = cyclops:ADR03AKSZ-REEL7: Ultracompact, Precision 10.0 V/5.0 V/2.5 V/3.0 V Voltage References; MPN: ADR03AKSZ-REEL7; OC_FARNELL: 1838919; OC_NEWARK: 59K2675; PACKAGE: SC70-5; SUPPLIER: Analog Devices
U10 U13 = jonnew:OPAMP
U11 U14 = cyclops:ZXTD4591E6: NPN/PNP Gate Driver
U12 = jonnew:SPST_IC
U15 = jonnew:TXB0104
U16 = jonnew:QUAD-OPAMP_14PIN: OP AMP
UC = jonnew:TEENSY_3.1_CYCLOPS
VCTL<>CONT VREF<>TTL = jonnew:SPDT: SPDT Switch
X1 = jonnew:OE-LOGO